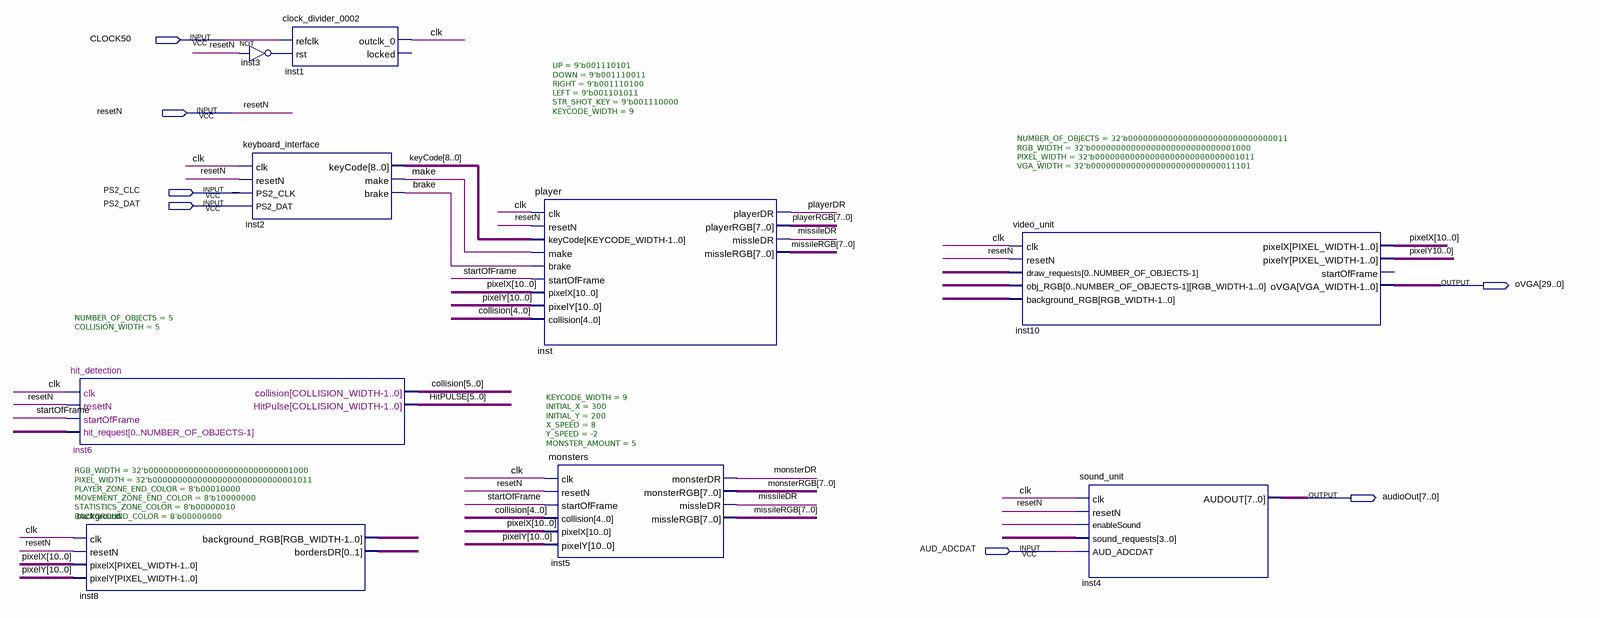
[diagram p0: schematic sheet]
// Quartus schematic space_invaders_TOP_LEVEL.bdf as structural Verilog: 9 symbols, 7 pins
module space_invaders_TOP_LEVEL (
  input  CLOCK50,
  input  resetN,
  input  PS2_CLC,
  input  PS2_DAT,
  input  AUD_ADCDAT,
  output [29:0] oVGA,
  output [7:0] audioOut
);

  wire brake, clk, inst3_out, make, missileDR, monsterDR, \pixelY10..0] , playerDR, startOfFrame, undriven_5;
  wire [1:0] inst8_bordersdr;
  wire [3:0] undriven_6;
  wire [4:0] undriven;
  wire [5:0] collision, HitPULSE;
  wire [7:0] missileRGB, monsterRGB, playerRGB;
  wire [8:0] keyCode;
  wire [10:0] pixelX, pixelY, undriven_2;
  wire [999:0] inst8_background_rgb, undriven_4;
  wire [10999:0] undriven_3;

  hit_detection #(.NUMBER_OF_OBJECTS(5), .COLLISION_WIDTH(5)) inst6 (
    .clk(clk), .resetN(resetN), .startOfFrame(startOfFrame), .hit_request(undriven), .collision(collision),
    .HitPulse(HitPULSE));
  background #(.RGB_WIDTH(32'b00000000000000000000000000001000), .PIXEL_WIDTH(32'b00000000000000000000000000001011), .PLAYER_ZONE_END_COLOR(8'b00010000), .MOVEMENT_ZONE_END_COLOR(8'b10000000), .STATISTICS_ZONE_COLOR(8'b00000010), .BACKGROUND_COLOR(8'b00000000)) inst8 (
    .clk(clk), .resetN(resetN), .pixelX(pixelX), .pixelY(pixelY), .background_RGB(inst8_background_rgb),
    .bordersDR(inst8_bordersdr));
  not inst3 (inst3_out, resetN);
  keyboard_interface inst2 (
    .clk(clk), .resetN(resetN), .PS2_CLK(PS2_CLC), .PS2_DAT(PS2_DAT), .keyCode(keyCode), .make(make),
    .brake(brake));
  clock_divider_0002 inst1 (.refclk(CLOCK50), .rst(inst3_out), .outclk_0(clk));  // open: locked
  player #(.UP(9'b001110101), .DOWN(9'b001110011), .RIGHT(9'b001110100), .LEFT(9'b001101011), .STR_SHOT_KEY(9'b001110000), .KEYCODE_WIDTH(9)) inst (
    .clk(clk), .resetN(resetN), .keyCode(keyCode), .make(make), .brake(brake), .startOfFrame(startOfFrame),
    .pixelX(pixelX), .pixelY(pixelY), .collision(collision[4:0]), .playerDR(playerDR), .playerRGB(playerRGB),
    .missleDR(missileDR), .missleRGB(missileRGB));
  monsters #(.KEYCODE_WIDTH(9), .INITIAL_X(300), .INITIAL_Y(200), .X_SPEED(8), .Y_SPEED(-2), .MONSTER_AMOUNT(5)) inst5 (
    .clk(clk), .resetN(resetN), .startOfFrame(startOfFrame), .collision(collision[4:0]), .pixelX(pixelX),
    .pixelY(pixelY), .monsterDR(monsterDR), .monsterRGB(monsterRGB), .missleDR(missileDR),
    .missleRGB(missileRGB));
  video_unit #(.NUMBER_OF_OBJECTS(32'b00000000000000000000000000000011), .RGB_WIDTH(32'b00000000000000000000000000001000), .PIXEL_WIDTH(32'b00000000000000000000000000001011), .VGA_WIDTH(32'b00000000000000000000000000011101)) inst10 (
    .clk(clk), .resetN(resetN), .draw_requests(undriven_2), .obj_RGB(undriven_3),
    .background_RGB(undriven_4), .pixelX(pixelX), .pixelY(\pixelY10..0] ), .oVGA(oVGA));  // open: startOfFrame
  sound_unit inst4 (
    .clk(clk), .resetN(resetN), .enableSound(undriven_5), .sound_requests(undriven_6),
    .AUD_ADCDAT(AUD_ADCDAT), .AUDOUT(audioOut));
endmodule
